# Altium schematic sheet _power.SchDoc
size Tabloid
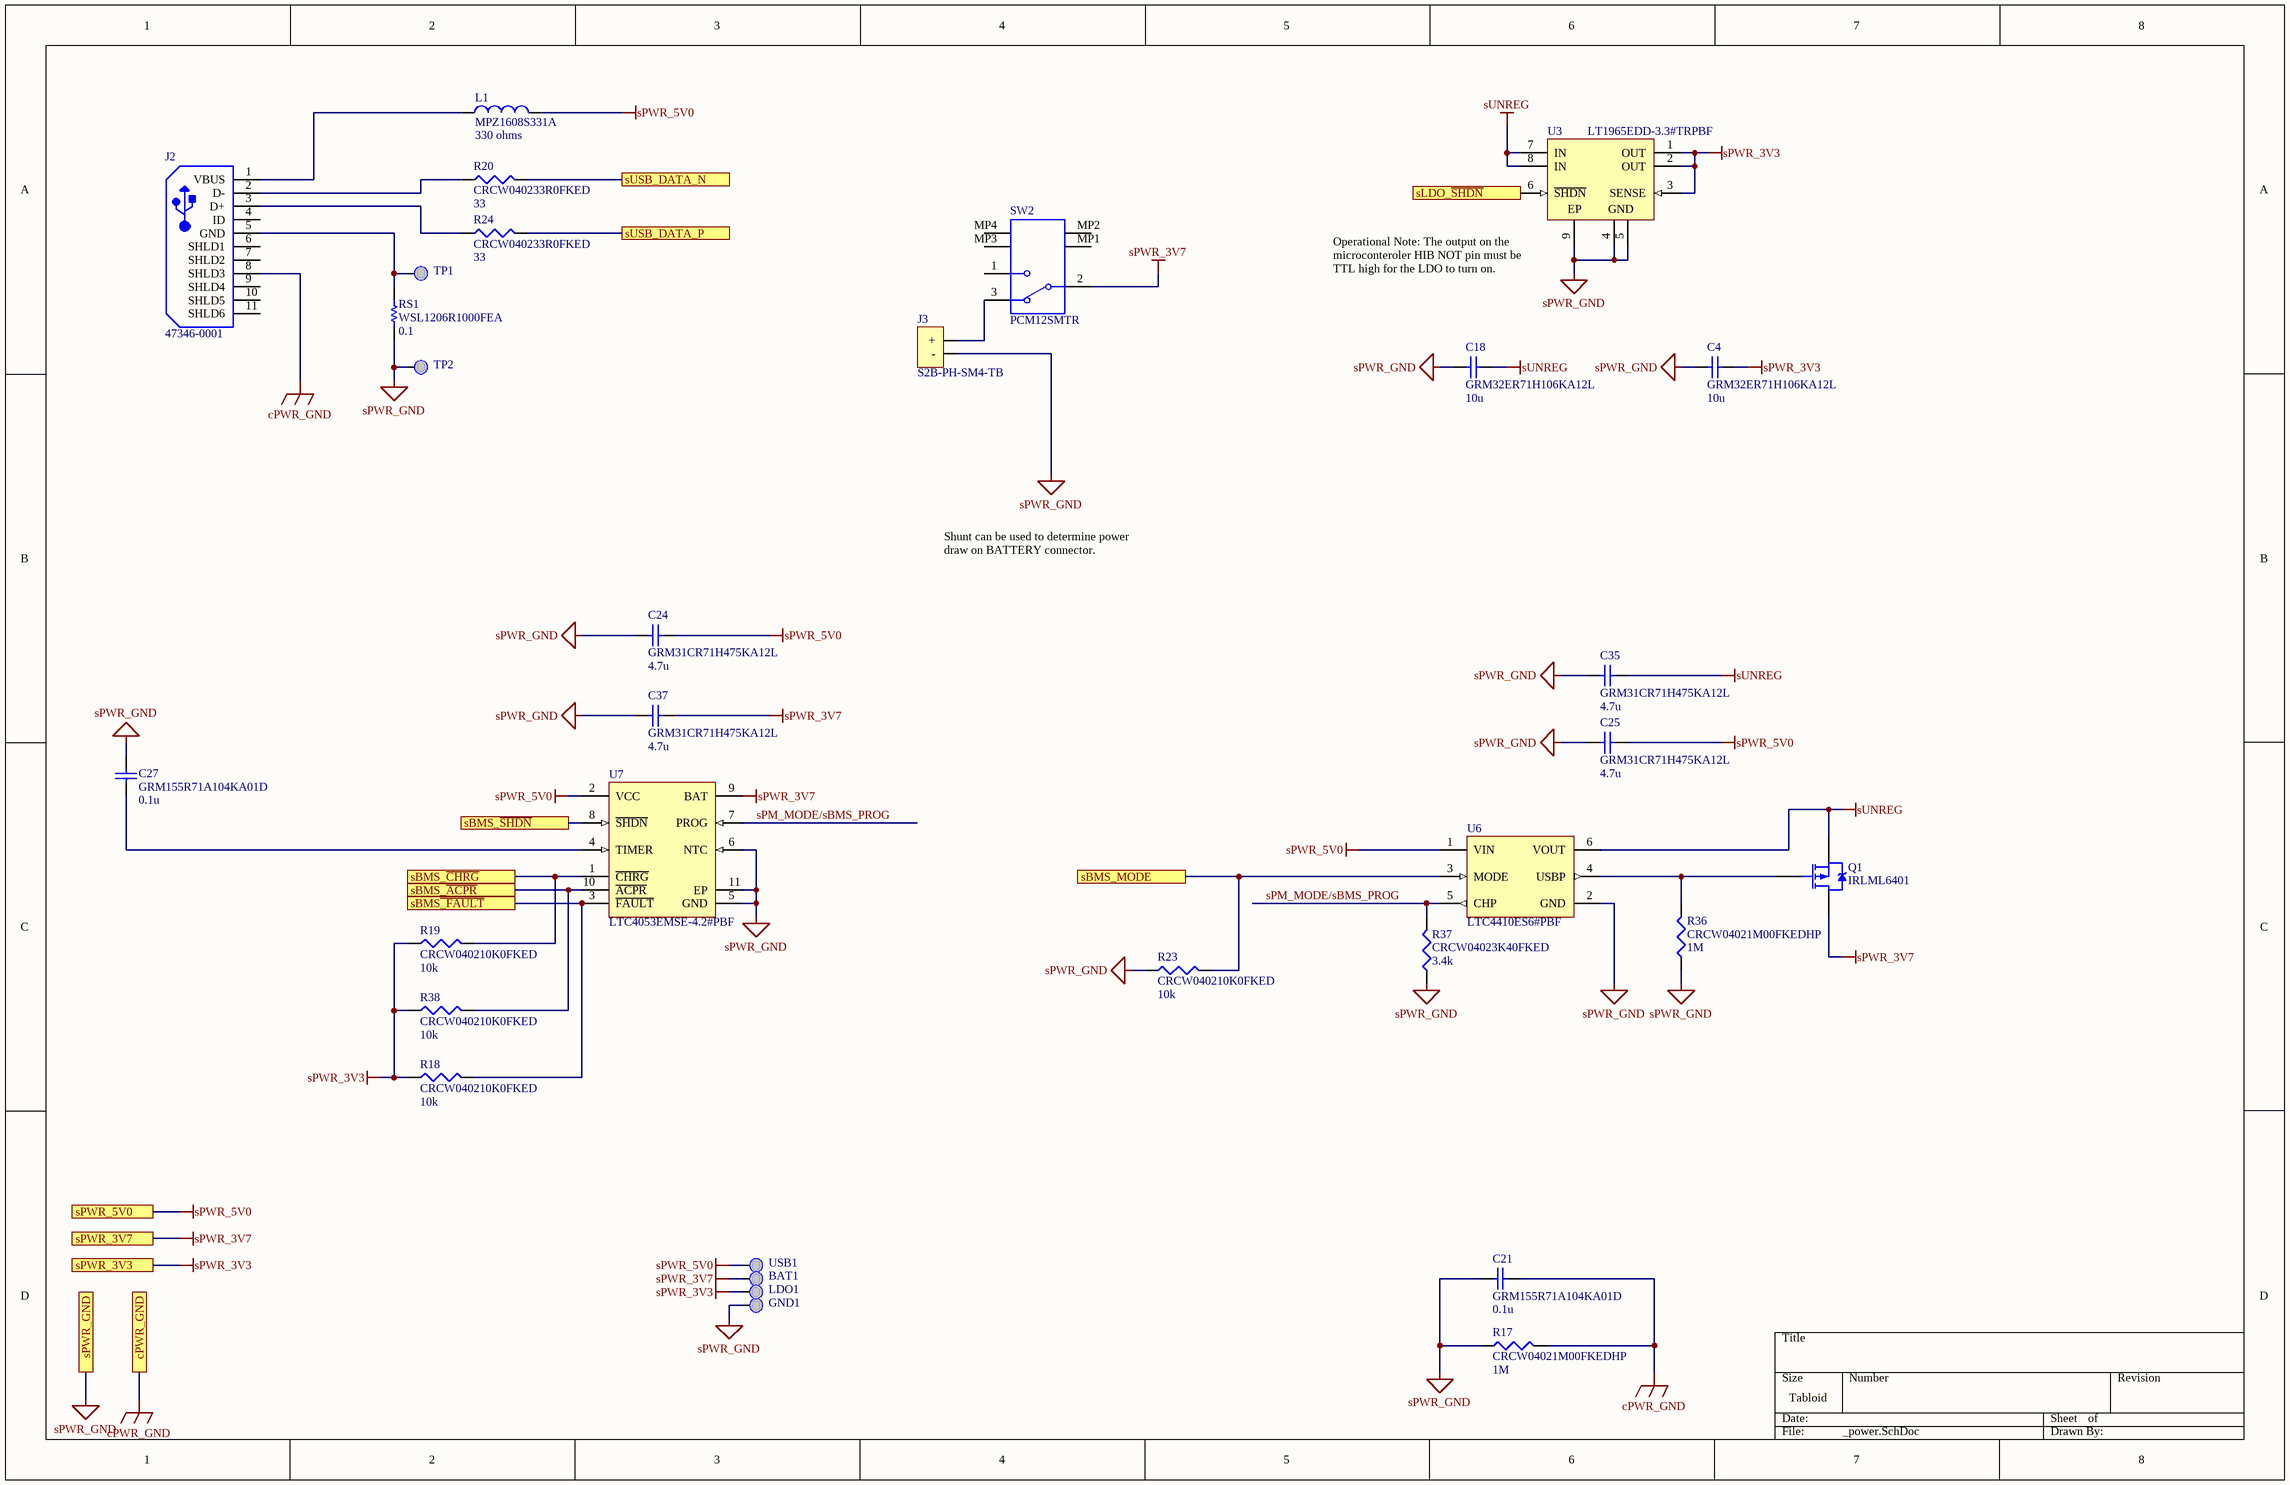
[diagram p0: _power.SchDoc]

## Parts
BAT1  TP  [TP_TH]  (value not drawn)
C4  GRM32ER71H106KA12L  value 10u  [1210]
C18  GRM32ER71H106KA12L  value 10u  [1210]
C21  GRM155R71A104KA01D  value 0.1u  [0402]
C24  GRM31CR71H475KA12L  value 4.7u  [1206]
C25  GRM31CR71H475KA12L  value 4.7u  [1206]
C27  GRM155R71A104KA01D  value 0.1u  [0402]
C35  GRM31CR71H475KA12L  value 4.7u  [1206]
C37  GRM31CR71H475KA12L  value 4.7u  [1206]
GND1  TP  [TP_TH]  (value not drawn)
J2  47346-0001  [MOLX-47346-0001-5_V]
J3  S2B-PH-SM4-TB  [S2B-PH-SM4-TB]
L1  MPZ1608S331A  value 330 ohms  [1608[0603]]
LDO1  TP  [TP_TH]  (value not drawn)
Q1  IRLML6401  [Micro3_N]
R17  CRCW04021M00FKEDHP  value 1M  [0402]
R18  CRCW040210K0FKED  value 10k  [0402]
R19  CRCW040210K0FKED  value 10k  [0402]
R20  CRCW040233R0FKED  value 33  [0402]
R23  CRCW040210K0FKED  value 10k  [0402]
R24  CRCW040233R0FKED  value 33  [0402]
R36  CRCW04021M00FKEDHP  value 1M  [0402]
R37  CRCW04023K40FKED  value 3.4k  [0402]
R38  CRCW040210K0FKED  value 10k  [0402]
RS1  WSL1206R1000FEA  value 0.1  [C1206]
SW2  PCM12SMTR  [CKCP-PCM12SMTR_V]
TP1  TP  [TP_TH]  (value not drawn)
TP2  TP  [TP_TH]  (value not drawn)
U3  LT1965EDD-3.3#TRPBF  [LT-DD-8_V]
U6  LTC4410ES6#PBF  [LT-S6-6-TSOT-23_N]
U7  LTC4053EMSE-4.2#PBF  [LT-MSE-10-EDP-2060x1830TP_N]
USB1  TP  [TP_TH]  (value not drawn)

## Ports
cPWR_GND, sBMS_MODE, sBMS_~{ACPR}, sBMS_~{CHRG}, sBMS_~{SHDN}, sBMS~{_FAULT}, sLDO_~{SHDN}, sPWR_3V3, sPWR_3V7, sPWR_5V0, sPWR_GND, sUSB_DATA_N, sUSB_DATA_P

## Nets
cPWR_GND: C21.2 J2.8(SHLD3) R17.2 ; port cPWR_GND
sPWR_3V3: C4.2 LDO1.1 R18.1 R19.1 R38.1 U3.1(OUT) U3.2(OUT) U3.3(SENSE) ; port sPWR_3V3
sPWR_3V7: BAT1.1 C37.2 Q1.3(D) SW2.2 U7.9(BAT) ; port sPWR_3V7
sPWR_5V0: C24.2 C25.2 L1.2 U6.1(VIN) U7.2(VCC) USB1.1 ; port sPWR_5V0
sPWR_GND: C4.1 C18.1 C21.1 C24.1 C25.1 C27.1 C35.1 C37.1 GND1.1 J3.1(-) R17.1 R23.1 R36.1 R37.1 RS1.1 TP2.1 U3.4(GND) U3.5(GND) U3.9(EP) U6.2(GND) U7.5(GND) U7.6(NTC) U7.11(EP) ; port sPWR_GND
sUNREG: C18.2 C35.2 Q1.2(S) U3.7(IN) U3.8(IN) U6.6(VOUT)
sBMS~{_FAULT}: R18.2 U7.3(~{FAULT}) ; port sBMS~{_FAULT}
sBMS_~{ACPR}: R38.2 U7.10(~{ACPR}) ; port sBMS_~{ACPR}
sBMS_~{CHRG}: R19.2 U7.1(~{CHRG}) ; port sBMS_~{CHRG}
sBMS_MODE: R23.2 U6.3(MODE) ; port sBMS_MODE
sBMS_~{SHDN}: U7.8(~{SHDN}) ; port sBMS_~{SHDN}
sLDO_~{SHDN}: U3.6(~{SHDN}) ; port sLDO_~{SHDN}
sPM_MODE/sBMS_PROG: R37.2 U6.5(CHP) U7.7(PROG)
sUSB_DATA_N: R20.2 ; port sUSB_DATA_N
sUSB_DATA_P: R24.2 ; port sUSB_DATA_P
NetC27_2: C27.2 U7.4(TIMER)
NetJ2_1: J2.1(VBUS) L1.1
NetJ2_2: J2.2(D-) R20.1
NetJ2_3: J2.3(D+) R24.1
NetJ2_5: J2.5(GND) RS1.2 TP1.1
NetJ3_2: J3.2(+) SW2.3
NetQ1_1: Q1.1(G) R36.2 U6.4(USBP)

Not connected (* = marked no-connect by the designer): J2 4(ID) 6(SHLD1) 7(SHLD2) 9(SHLD4) 10(SHLD5) 11(SHLD6); SW2 1 MP1 MP2 MP3 MP4

## Notes on the sheet
- (near U3) Operational Note: The output on the microconteroler HIB NOT pin must be TTL high for the LDO to turn on.
- Shunt can be used to determine power draw on BATTERY connector.

## Library data of the parts
C4 C18 = GRM32ER71HxxxKdddd: -55-125C, 1005, 50V, X7R, ±10%
C21 C27 = GRM155R71AxxxKdddd: -55-125C, 1005, 10V, X7R, ±10%
C24 C25 C35 C37 = GRM31CR71HxxxKdddd: -55-125C, 3216, 50V, X7R, ±10%
J2 = CMP-2000-05246-1: Micro-USB B Receptacle with Flange, -30 to 85 degC, 5-Pin SMD, RoHS, Tape and Reel; Manufacturer: Molex; Number of Contacts: 5; Body Orientation: RightAngle; Maximum Voltage Rating: 30VAC; Pitch: 0.65mm; Maximum Current Rating: 1.8/ContactA; Number of Ports: 1; Gender: RCP; Operating Temperature: -30to85C; Part No: 47346-0001; Color: Black; Termination Method: Solder; Contact Plating: GoldOverPalladiumNickelOverNickel; Dimension: 7.8x5.43x2.94mm; Number of Terminals: 5; Datasheet Version: Dec-13; Datasheet URL: https://datasheet.ciiva.com/30075/304740473460001-io-nectors-30075527.pdf; Contact Material: CopperAlloy; RoHS: Yes; Housing Material: LiquidCrystalPolymer; Manufacturer URL: http://www.molex.com/; Packaging: EmbossedTapeandReel; Mounting: SurfaceMount; Type: MicroUSBTypeB
J3 = S2B-PH-SM4-TB: JST Battery Connector
L1 = Inductor: EMI Filter Beads, Chips & Arrays 0603 330ohms 100MHz Rdc 0.08ohms 1.7A; Code_IEC: 1005; Published: 8-Jun-2000; LatestRevisionDate: 29-May-2009; LatestRevisionNote: IPC-7351 Footprint Added.; PackageReference: 0402-A; Publisher: Altium Limited; PackageDescription: Chip Inductor; Code_JEITA: 0402
Q1 = IRLML6401: MOSFET P-CH 12V 4.3A SOT-23; Published: 17-Sep-2003; DatasheetVersion: 2-Jul-2001; PackageVersion: Jul-2001; PackageReference: Micro3; Publisher: Altium Limited; PackageDescription: 3-Pin SOT-23 Package 0.95 mm Pitch, 2.3 mm Lead Span; ComponentLink1Description: Manufacturer Link; ComponentLink1URL: http://www.irf.com/; ComponentLink2Description: Datasheet; ComponentLink2URL: http://www.irf.com/product-info/datasheets/data/IRLML6401.pdf
R17-R20 R23 R24 R36-R38 = CRCW0402xxxxFKED: 0.125W, -55-155C, 1005, 50V, ±1%
RS1 = Res Semi: Current Sense Resistors - SMD 1/4watt .1ohms 1%; Published: 8-Jun-2000; LatestRevisionDate: 17-Jul-2002; LatestRevisionNote: Re-released for DXP Platform.; PackageReference: AXIAL-0.5; Publisher: Altium Limited; PackageDescription: Axial Device, Thru-Hole; 2 Leads; 0.5 in Pin Spacing
SW2 = CMP-2000-06884-1: Ultraminiature Slide Switch, SPDT, 0.3 A, 6 V, -20 to 85 degC, 3-Pin SMD, RoHS, Tape and Reel; Manufacturer: C&K Components; Switch Operation: On-On; Contact Current-Max: 0.3A; Datasheet Version: 02/2016; Package Reference: PCM12SMTR; Package Description: 3-Pin Surface Mount Device, Body 6.7 x 2.6 mm; Contact Material: SilverOverCopper; Mounting Technology: SurfaceMount; Circuitry: SPDT; Datasheet URL: http://www.ck-components.com/media/1424/pcm.pdf; Termination Style: RightAngle/SurfaceMount; Manufacturer URL: http://www.ckswitches.com/
U3 = CMP-0476-00225-1: 1.1 A, Low Noise, Low Dropout Linear Regulator, 1.8 to 20 V Vin, 3.3 V Vout, 8-pin SON (DD-8), -40 to 125 degC, Pb-Free, Tape and Reel; Manufacturer: Linear Technology; Number of Outputs: 1; Iout(mA): 1100; Noise(uV): 40; Dropout Voltage(V): 0.31; Discrete Pass Element: no; Vin Max(V): 20; Output Voltage: 3.3 V; PSRR(dB): 75; Isupply(mA): 0.5; Vin Min(V): 1.8; PackageReference: DD-8; PackageDescription: 8-Pin Plastic DFN, Body 3 x 3 mm, Pitch 0.5 mm; Code_JEDEC: MO-229; ComponentLink2URL: http://cds.linear.com/docs/en/datasheet/1965fa.pdf; PackageVersion: Jun-10; ComponentLink3URL: http://cds.linear.com/docs/en/packaging/DFN_8_05-08-1698.pdf; ComponentLink2Description: Datasheet; Packing: Tape and Reel; Shutdown Current(uA): 1; PartNumber: LT1965EDD-3.3#TRPBF; ComponentLink1URL: http://www.linear.com/; RoHS: TRUE; Mounting Technology: Surface Mount; ComponentLink3Description: Package Specification; ComponentLink1Description: Manufacturer URL; DatasheetVersion: Rev. A
U6 = LTC4410ES6#PBF: USB Power Manager, 4.35 to 5.5 V Vin, 6-pin SOT23 (S6-6), -40 to 85 degC, Pb-Free; Manufacturer: Linear Technology; Ideal Diode: Single, External, P-Channel; PackageVersion: Jun-10; PackageReference: S6-6; PackageDescription: 6-Pin Plastic TSOT-23, Body 2.9 x 1.63 mm, Pitch 0.95 mm; Supplier 1: Newark; Supplier Part Number 1: 78T3424; RoHS: TRUE; Mounting Technology: Surface Mount; Code_JEDEC: MO-193; PartNumber: LTC4410ES6#PBF; ComponentLink1Description: Manufacturer URL; ComponentLink1URL: http://www.linear.com/; ComponentLink2Description: Datasheet; ComponentLink2URL: http://cds.linear.com/docs/en/datasheet/4410fs.pdf; ComponentLink3Description: Package Specification; ComponentLink3URL: http://cds.linear.com/docs/en/packaging/SOT_6_05-08-1636.pdf
U7 = LTC4053EMSE-4.2#PBF: USB Compatible Lithium-Ion Battery Charger with Thermal Regulation, 4.25 to 6.5 V Vin, 10-pin SOP (MSE-10-EDP), -40 to 85 degC, Pb-Free; Manufacturer: Linear Technology; Battery Chemistry: Li-Ion, Li-Polymer; Charge Termination: On-board timer; Float Voltage: 4.2 V; Max Charge Current(A): 1.25; Number of Cells: 1; Type of Charger: Linear; Vin Max(V): 6.5; Vin Min(V): 4.25; DatasheetVersion: Rev. A; PackageVersion: Rev. C, 08/2009; PackageReference: MSE-10; PackageDescription: 10-Pin Plastic MSOP, Exposed Die Pad, Body 3 x 3 mm, Pitch 0.5 mm; Supplier 1: Digi-Key; Supplier Part Number 1: LTC4053EMSE-4.2#PBF-ND; Supplier 2: Farnell; Supplier Part Number 2: 1663727; Supplier 3: Newark; Supplier Part Number 3: 58M0850; RoHS: TRUE; Mounting Technology: Surface Mount; PartNumber: LTC4053EMSE-4.2#PBF; ComponentLink1Description: Manufacturer URL; ComponentLink1URL: http://www.linear.com/; ComponentLink2Description: Datasheet; ComponentLink2URL: http://cds.linear.com/docs/en/datasheet/4053-4.2fs.pdf; ComponentLink3Description: Package Specification; ComponentLink3URL: http://cds.linear.com/docs/en/datasheet/3481fc.pdf